# EAGLE design belamini_breakout_v01 (EAGLE 9.3.2)

## Sheet 1 of 5: Headers
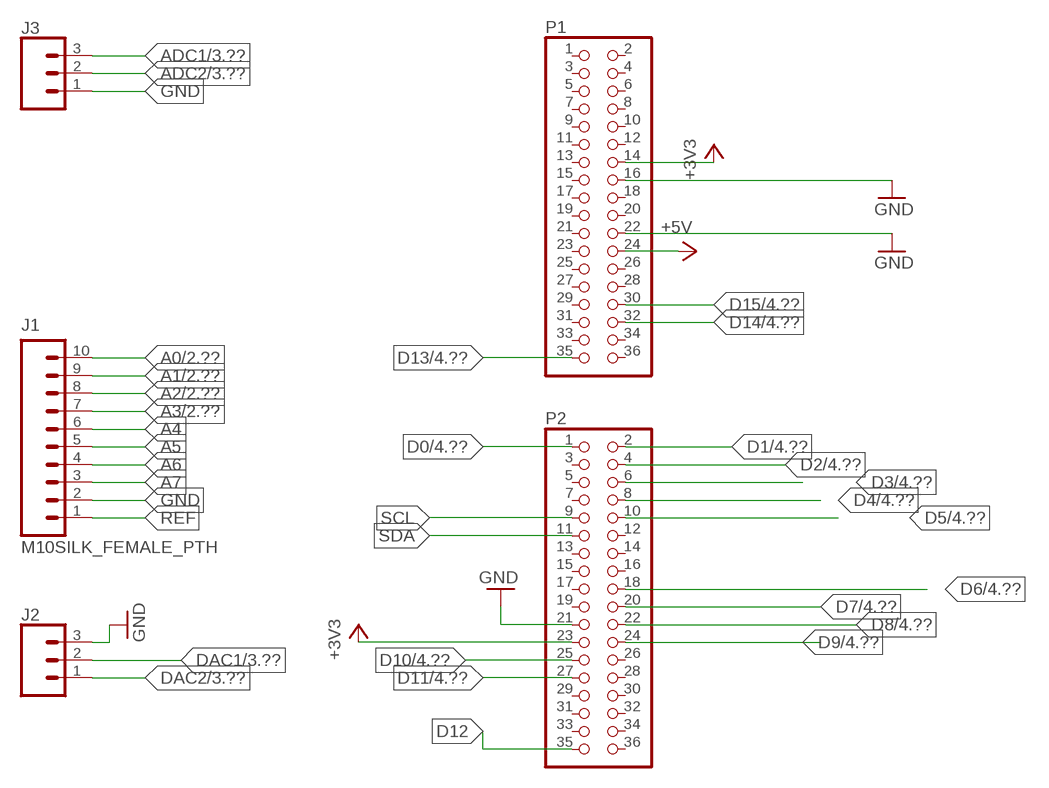
[diagram p0: schematic, sheet 1]

### Parts
J1  M10SILK_FEMALE_PTH  [1X10]
J2  CONN_03  [1X03]
J3  CONN_03  [1X03]
P1  PINHD-2X18  [2X18]
P2  PINHD-2X18  [2X18]

### Nets
+3V3: P1.14 P2.23 ; also sheet 4,5
+5V: P1.24 ; also sheet 5
A0: J1.10 ; also sheet 2
A1: J1.9 ; also sheet 2
A2: J1.8 ; also sheet 2
A3: J1.7 ; also sheet 2
A4: J1.6
A5: J1.5
A6: J1.4
A7: J1.3
ADC1: J3.3 ; also sheet 3
ADC2: J3.2 ; also sheet 3
D0: P2.1 ; also sheet 4
D1: P2.2 ; also sheet 4
D2: P2.4 ; also sheet 4
D3: P2.6 ; also sheet 4
D4: P2.8 ; also sheet 4
D5: P2.10 ; also sheet 4
D6: P2.18 ; also sheet 4
D7: P2.20 ; also sheet 4
D8: P2.22 ; also sheet 4
D9: P2.24 ; also sheet 4
D10: P2.25 ; also sheet 4
D11: P2.27 ; also sheet 4
D12: P2.35
D13: P1.35 ; also sheet 4
D14: P1.32 ; also sheet 4
D15: P1.30 ; also sheet 4
DAC1: J2.2 ; also sheet 3
DAC2: J2.1 ; also sheet 3
GND: J1.2 J2.3 J3.1 P1.16 P1.22 P2.21 ; also sheet 2,3,4,5
REF: J1.1
SCL: P2.9
SDA: P2.11
Unconnected: P1.1 P1.2 P1.3 P1.4 P1.5 P1.6 P1.7 P1.8 P1.9 P1.10 P1.11 P1.12 P1.13 P1.15 P1.17 P1.18 P1.19 P1.20 P1.21 P1.23 P1.25 P1.26 P1.27 P1.28 P1.29 P1.31 P1.33 P1.34 P1.36 P2.3 P2.5 P2.7 P2.12 P2.13 P2.14 P2.15 P2.16 P2.17 P2.19 P2.26 P2.28 P2.29 P2.30 P2.31 P2.32 P2.33 P2.34 P2.36

## Sheet 2 of 5: Analog Inputs
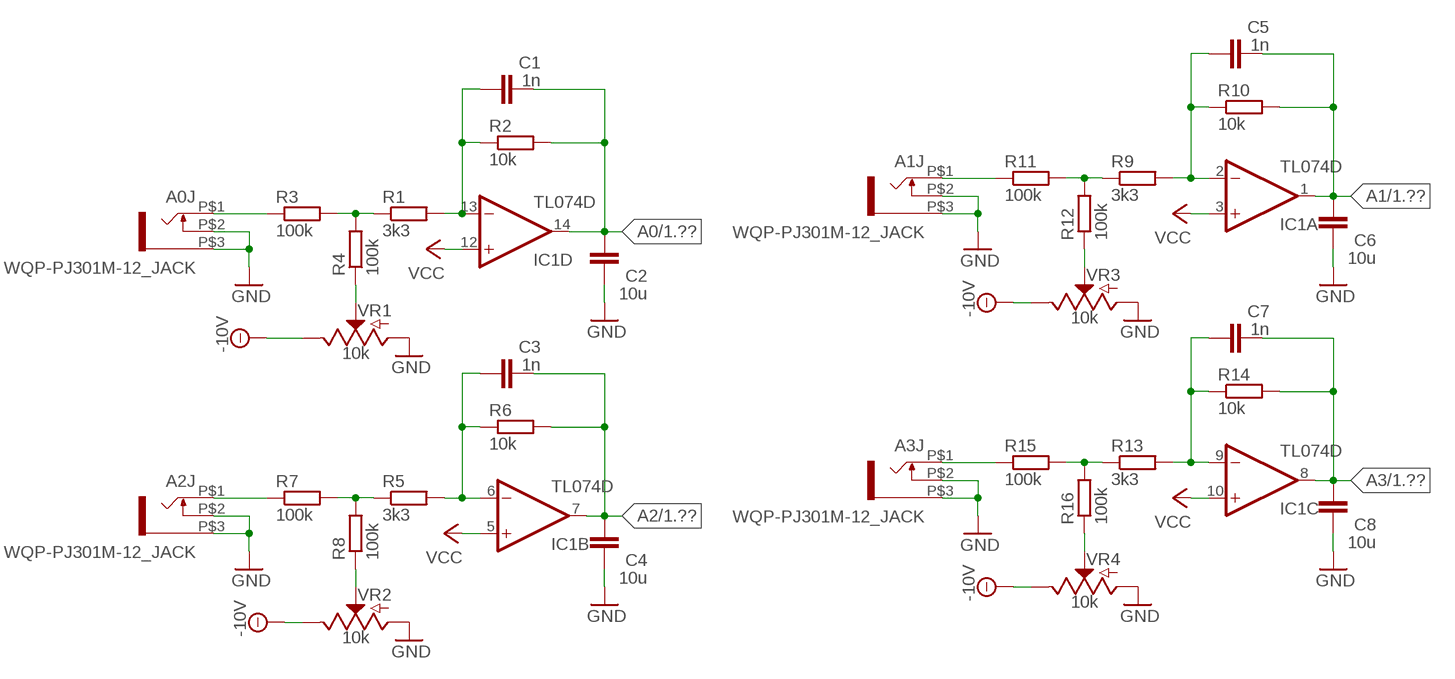
[diagram p1: schematic, sheet 2]

### Parts
A0J  WQP-PJ301M-12_JACK  [WQP-PJ301M-12_JACK]
A1J  WQP-PJ301M-12_JACK  [WQP-PJ301M-12_JACK]
A2J  WQP-PJ301M-12_JACK  [WQP-PJ301M-12_JACK]
A3J  WQP-PJ301M-12_JACK  [WQP-PJ301M-12_JACK]
C1  1n  C-EUC0603  [C0603]
C2  10u  C-EUC0603  [C0603]
C3  1n  C-EUC0603  [C0603]
C4  10u  C-EUC0603  [C0603]
C5  1n  C-EUC0603  [C0603]
C6  10u  C-EUC0603  [C0603]
C7  1n  C-EUC0603  [C0603]
C8  10u  C-EUC0603  [C0603]
IC1  TL074D  [SO14]
R1  3k3  R-EU_R0603  [R0603]
R2  10k  R-EU_R0603  [R0603]
R3  100k  R-EU_R0603  [R0603]
R4  100k  R-EU_R0603  [R0603]
R5  3k3  R-EU_R0603  [R0603]
R6  10k  R-EU_R0603  [R0603]
R7  100k  R-EU_R0603  [R0603]
R8  100k  R-EU_R0603  [R0603]
R9  3k3  R-EU_R0603  [R0603]
R10  10k  R-EU_R0603  [R0603]
R11  100k  R-EU_R0603  [R0603]
R12  100k  R-EU_R0603  [R0603]
R13  3k3  R-EU_R0603  [R0603]
R14  10k  R-EU_R0603  [R0603]
R15  100k  R-EU_R0603  [R0603]
R16  100k  R-EU_R0603  [R0603]
VR1  10k  POTENTIOMETER-PTH-9MM-1/20W-20%-KIT  [POT-PTH-ALPS-KIT]
VR2  10k  POTENTIOMETER-PTH-9MM-1/20W-20%-KIT  [POT-PTH-ALPS-KIT]
VR3  10k  POTENTIOMETER-PTH-9MM-1/20W-20%-KIT  [POT-PTH-ALPS-KIT]
VR4  10k  POTENTIOMETER-PTH-9MM-1/20W-20%-KIT  [POT-PTH-ALPS-KIT]

### Nets
-10V: VR1.P$1(E) VR2.P$1(E) VR3.P$1(E) VR4.P$1(E) ; also sheet 5
A0: C1.2 C2.2 IC1.14(D:OUT) R2.2 ; also sheet 1
A1: C5.2 C6.2 IC1.1(A:OUT) R10.2 ; also sheet 1
A2: C3.2 C4.2 IC1.7(B:OUT) R6.2 ; also sheet 1
A3: C7.2 C8.2 IC1.8(C:OUT) R14.2 ; also sheet 1
GND: A0J.P$2 A0J.P$3 A1J.P$2 A1J.P$3 A2J.P$2 A2J.P$3 A3J.P$2 A3J.P$3 C2.1 C4.1 C6.1 C8.1 VR1.P$3(A) VR2.P$3(A) VR3.P$3(A) VR4.P$3(A) ; also sheet 1,3,4,5
N$1: A0J.P$1 R3.1
N$2: C1.1 IC1.13(D:-IN) R1.2 R2.1
N$3: R1.1 R3.2 R4.2
N$4: R4.1 VR1.P$2(S)
N$5: C3.1 IC1.6(B:-IN) R5.2 R6.1
N$6: R5.1 R7.2 R8.2
N$7: A2J.P$1 R7.1
N$8: R8.1 VR2.P$2(S)
N$9: C5.1 IC1.2(A:-IN) R9.2 R10.1
N$10: R9.1 R11.2 R12.2
N$11: A1J.P$1 R11.1
N$12: R12.1 VR3.P$2(S)
N$13: C7.1 IC1.9(C:-IN) R13.2 R14.1
N$14: R13.1 R15.2 R16.2
N$15: A3J.P$1 R15.1
N$16: R16.1 VR4.P$2(S)
VCC: IC1.3(A:+IN) IC1.5(B:+IN) IC1.10(C:+IN) IC1.12(D:+IN) ; also sheet 3,5

## Sheet 3 of 5: Audio IO
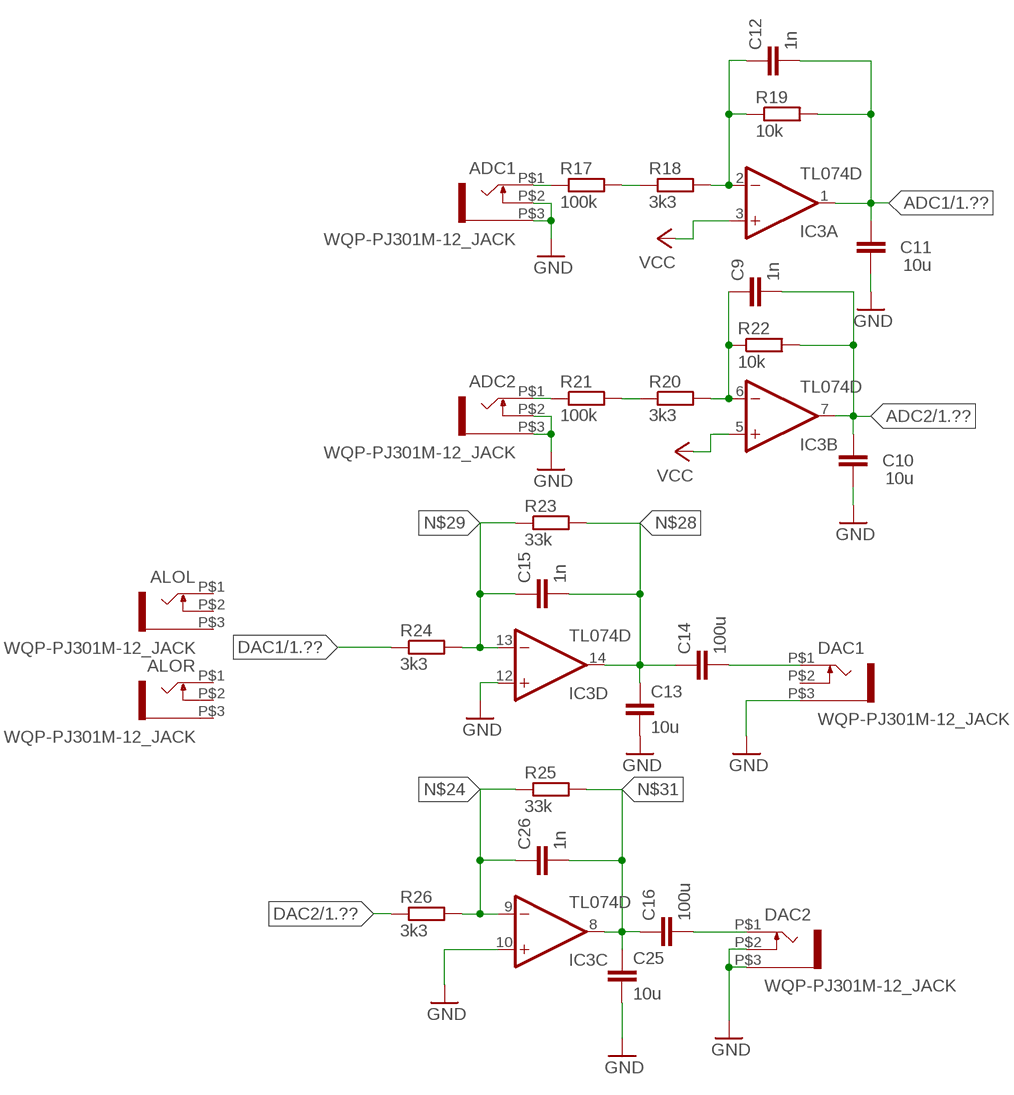
[diagram p2: schematic, sheet 3]

### Parts
ADC1  WQP-PJ301M-12_JACK  [WQP-PJ301M-12_JACK]
ADC2  WQP-PJ301M-12_JACK  [WQP-PJ301M-12_JACK]
ALOL  WQP-PJ301M-12_JACK  [WQP-PJ301M-12_JACK]
ALOR  WQP-PJ301M-12_JACK  [WQP-PJ301M-12_JACK]
C9  1n  C-EUC0603  [C0603]
C10  10u  C-EUC0603  [C0603]
C11  10u  C-EUC0603  [C0603]
C12  1n  C-EUC0603  [C0603]
C13  10u  C-EUC0603  [C0603]
C14  100u  C-EUC0603  [C0603]
C15  1n  C-EUC0603  [C0603]
C16  100u  C-EUC0603  [C0603]
C25  10u  C-EUC0603  [C0603]
C26  1n  C-EUC0603  [C0603]
DAC1  WQP-PJ301M-12_JACK  [WQP-PJ301M-12_JACK]
DAC2  WQP-PJ301M-12_JACK  [WQP-PJ301M-12_JACK]
IC3  TL074D  [SO14]
R17  100k  R-EU_R0603  [R0603]
R18  3k3  R-EU_R0603  [R0603]
R19  10k  R-EU_R0603  [R0603]
R20  3k3  R-EU_R0603  [R0603]
R21  100k  R-EU_R0603  [R0603]
R22  10k  R-EU_R0603  [R0603]
R23  33k  R-EU_R0603  [R0603]
R24  3k3  R-EU_R0603  [R0603]
R25  33k  R-EU_R0603  [R0603]
R26  3k3  R-EU_R0603  [R0603]

### Nets
ADC1: C11.2 C12.2 IC3.1(A:OUT) R19.2 ; also sheet 1
ADC2: C9.2 C10.2 IC3.7(B:OUT) R22.2 ; also sheet 1
DAC1: R24.1 ; also sheet 1
DAC2: R26.1 ; also sheet 1
GND: ADC1.P$2 ADC1.P$3 ADC2.P$2 ADC2.P$3 C10.1 C11.1 C13.2 C25.2 DAC1.P$3 DAC2.P$2 DAC2.P$3 IC3.10(C:+IN) IC3.12(D:+IN) ; also sheet 1,2,4,5
N$20: ADC1.P$1 R17.1
N$21: R17.2 R18.1
N$22: C12.1 IC3.2(A:-IN) R18.2 R19.1
N$23: C9.1 IC3.6(B:-IN) R20.2 R22.1
N$24: C26.1 IC3.9(C:-IN) R25.1 R26.2
N$25: R20.1 R21.2
N$26: ADC2.P$1 R21.1
N$27: C14.2 DAC1.P$1
N$28: C13.1 C14.1 C15.2 IC3.14(D:OUT) R23.2
N$29: C15.1 IC3.13(D:-IN) R23.1 R24.2
N$31: C16.1 C25.1 C26.2 IC3.8(C:OUT) R25.2
N$32: C16.2 DAC2.P$1
VCC: IC3.3(A:+IN) IC3.5(B:+IN) ; also sheet 2,5
Unconnected: ALOL.P$1 ALOL.P$2 ALOL.P$3 ALOR.P$1 ALOR.P$2 ALOR.P$3 DAC1.P$2

## Sheet 4 of 5: Buttons and Encoder
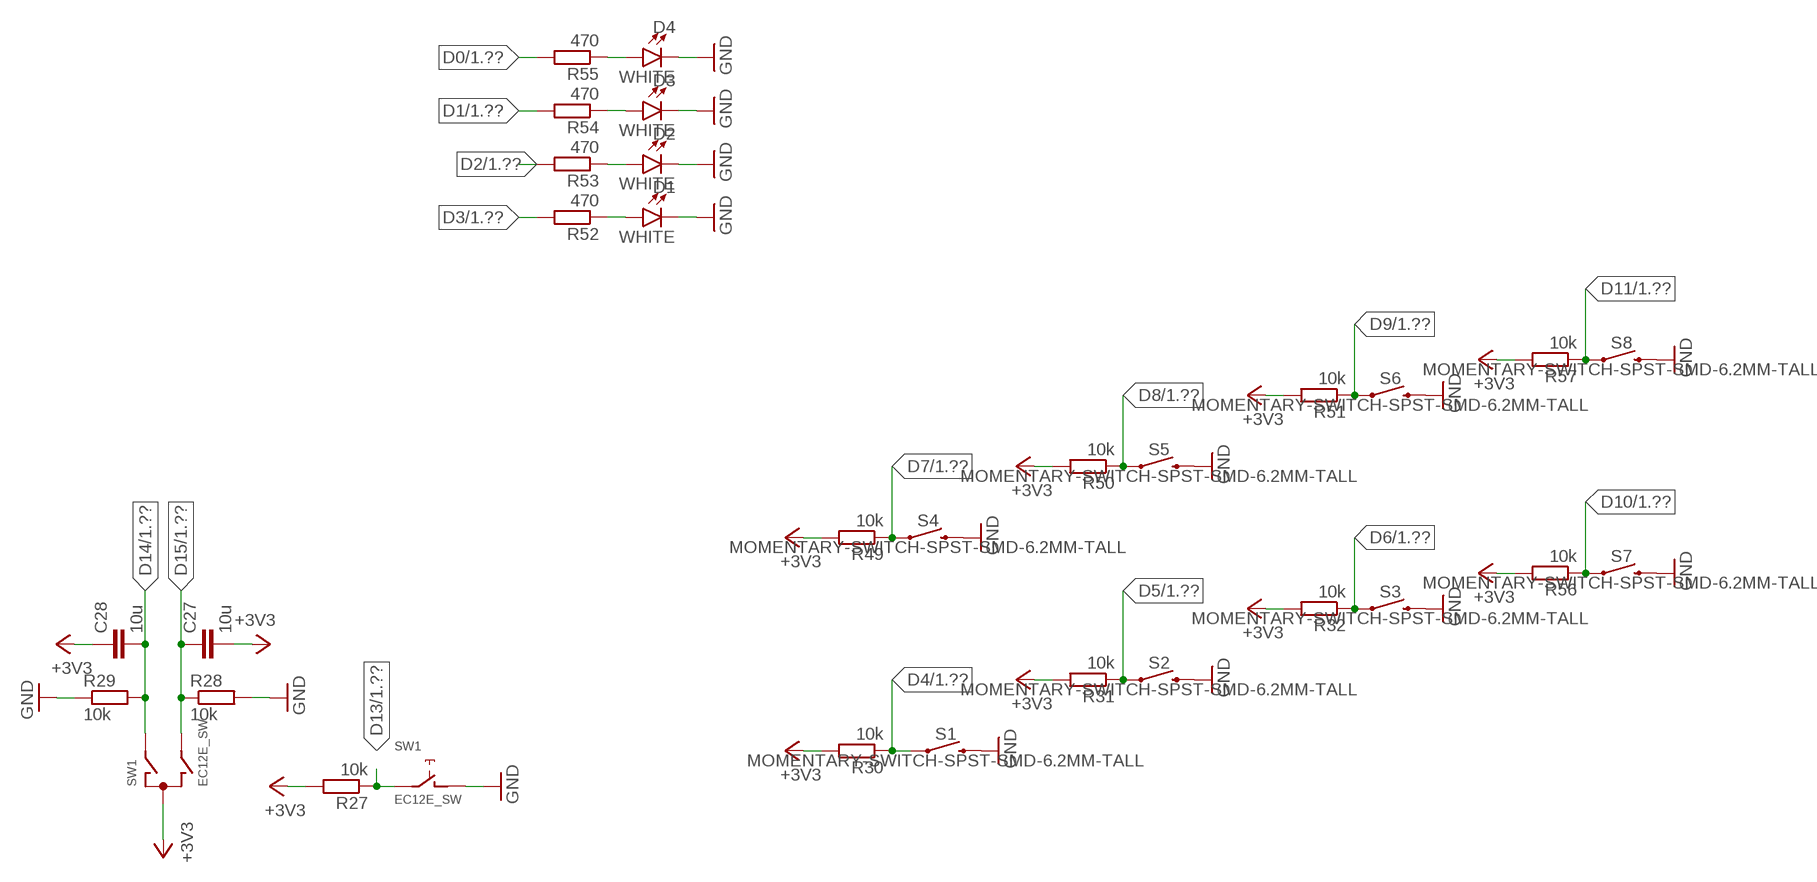
[diagram p3: schematic, sheet 4]

### Parts
C27  10u  C-EUC0603  [C0603]
C28  10u  C-EUC0603  [C0603]
D1  WHITE  LED-WHITE1206  [LED-1206]
D2  WHITE  LED-WHITE1206  [LED-1206]
D3  WHITE  LED-WHITE1206  [LED-1206]
D4  WHITE  LED-WHITE1206  [LED-1206]
R27  10k  R-EU_R0603  [R0603]
R28  10k  R-EU_R0603  [R0603]
R29  10k  R-EU_R0603  [R0603]
R30  10k  R-EU_R0603  [R0603]
R31  10k  R-EU_R0603  [R0603]
R32  10k  R-EU_R0603  [R0603]
R49  10k  R-EU_R0603  [R0603]
R50  10k  R-EU_R0603  [R0603]
R51  10k  R-EU_R0603  [R0603]
R52  470  R-EU_R0603  [R0603]
R53  470  R-EU_R0603  [R0603]
R54  470  R-EU_R0603  [R0603]
R55  470  R-EU_R0603  [R0603]
R56  10k  R-EU_R0603  [R0603]
R57  10k  R-EU_R0603  [R0603]
S1  MOMENTARY-SWITCH-SPST-SMD-6.2MM-TALL  [TACTILE_SWITCH_SMD_6.2MM_TALL]
S2  MOMENTARY-SWITCH-SPST-SMD-6.2MM-TALL  [TACTILE_SWITCH_SMD_6.2MM_TALL]
S3  MOMENTARY-SWITCH-SPST-SMD-6.2MM-TALL  [TACTILE_SWITCH_SMD_6.2MM_TALL]
S4  MOMENTARY-SWITCH-SPST-SMD-6.2MM-TALL  [TACTILE_SWITCH_SMD_6.2MM_TALL]
S5  MOMENTARY-SWITCH-SPST-SMD-6.2MM-TALL  [TACTILE_SWITCH_SMD_6.2MM_TALL]
S6  MOMENTARY-SWITCH-SPST-SMD-6.2MM-TALL  [TACTILE_SWITCH_SMD_6.2MM_TALL]
S7  MOMENTARY-SWITCH-SPST-SMD-6.2MM-TALL  [TACTILE_SWITCH_SMD_6.2MM_TALL]
S8  MOMENTARY-SWITCH-SPST-SMD-6.2MM-TALL  [TACTILE_SWITCH_SMD_6.2MM_TALL]
SW1  EC12E_SW  [ALPS_EC12E_SW]

### Nets
+3V3: C27.2 C28.1 R27.2 R30.2 R31.2 R32.2 R49.2 R50.2 R51.2 R56.2 R57.2 SW1.C ; also sheet 1,5
D0: R55.2 ; also sheet 1
D1: R54.2 ; also sheet 1
D2: R53.2 ; also sheet 1
D3: R52.2 ; also sheet 1
D4: R30.1 S1.A2 ; also sheet 1
D5: R31.1 S2.A2 ; also sheet 1
D6: R32.1 S3.A2 ; also sheet 1
D7: R49.1 S4.A2 ; also sheet 1
D8: R50.1 S5.A2 ; also sheet 1
D9: R51.1 S6.A2 ; also sheet 1
D10: R56.1 S7.A2 ; also sheet 1
D11: R57.1 S8.A2 ; also sheet 1
D13: R27.1 SW1.E ; also sheet 1
D14: C28.2 R29.2 SW1.A ; also sheet 1
D15: C27.1 R28.1 SW1.B ; also sheet 1
GND: D1.C D2.C D3.C D4.C R28.2 R29.1 S1.B2 S2.B2 S3.B2 S4.B2 S5.B2 S6.B2 S7.B2 S8.B2 SW1.D ; also sheet 1,2,3,5
N$30: D4.A R55.1
N$37: D3.A R54.1
N$41: D2.A R53.1
N$45: D1.A R52.1
Unconnected: SW1.GND1(G) SW1.GND2(G)

## Sheet 5 of 5: PSU
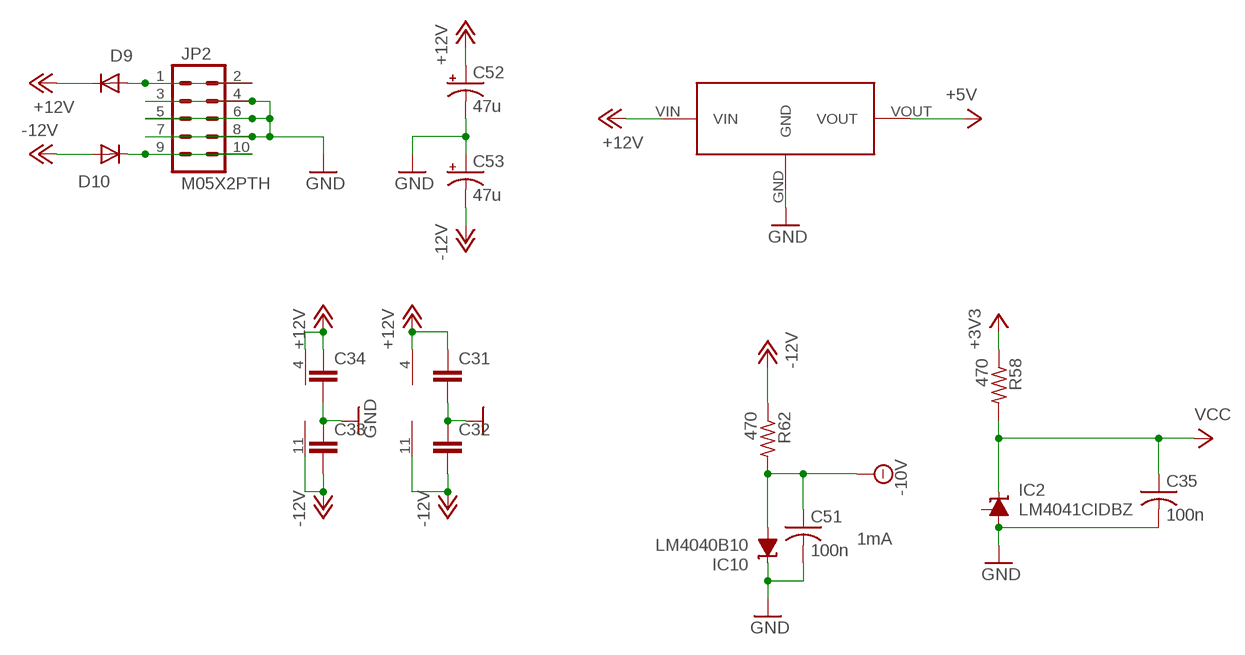
[diagram p4: schematic, sheet 5]

### Parts
C31  C-EUC0603  [C0603]
C32  C-EUC0603  [C0603]
C33  C-EUC0603  [C0603]
C34  C-EUC0603  [C0603]
C35  100n  C-USC0603  [C0603]
C51  100n  C-USC0603  [C0603]
C52  47u  CPOL-USD  [PANASONIC_D]
C53  47u  CPOL-USD  [PANASONIC_D]
D9  1N5819HW  DIODE-SOD123  [SOD123]
D10  1N5819HW  DIODE-SOD123  [SOD123]
IC2  LM4041CIDBZ  [DBZ_R-PDSO-G3]
IC10  LM4040B10  LM4041B12DBZ  [DBZ_R-PDSO-G3]
JP2  M05X2PTH  [AVR_ICSP]
R58  470  R-US_R0603  [R0603]
R62  470  R-US_R0603  [R0603]
U$1  RECOM785.0  [R-78XX-1.0]

### Nets
+3V3: R58.1 ; also sheet 1,4
+5V: U$1.VOUT ; also sheet 1
+12V: C31.1 C34.1 C52.+ D9.C IC1.4(P:V+) IC3.4(P:V+) U$1.VIN
-10V: C51.1 IC10.2(A) R62.2 ; also sheet 2
-12V: C32.2 C33.2 C53.- D10.A IC1.11(P:V-) IC3.11(P:V-) R62.1
GND: C31.2 C32.1 C33.1 C34.2 C35.2 C51.2 C52.- C53.+ IC2.3(A) IC10.1(C) JP2.3 JP2.4 JP2.5 JP2.6 JP2.7 JP2.8 U$1.GND ; also sheet 1,2,3,4
N$52: D9.A JP2.1 JP2.2
N$53: D10.C JP2.9 JP2.10
VCC: C35.1 IC2.2(C) R58.2 ; also sheet 2,3
Unconnected: IC2.1(FB)

### Notes on the sheet
- 1mA

## Library data of the parts
A0J A1J A2J A3J ADC1 ADC2 ALOL ALOR DAC1 DAC2 = thonkiconn:WQP-PJ301M-12_JACK
C1-C16 C25-C28 C31-C34 = resistor:C-EU: CAPACITOR, European symbol
C35 C51 = rcl:C-US: CAPACITOR, American symbol
C52 C53 = rcl:CPOL-US: POLARIZED CAPACITOR, American symbol
D1-D4 = SparkFun-LED:LED-WHITE: White SMD LED Used in manufacturing several products at SparkFun. Packages: 0603 - Bright White SMD 0603 package[Product Link] <http://www.kingbrightusa.com/product.asp?catalog_name=LED&product_id=APT1608QWF/D> 1206 - Bright White SMD1206 package [Product Link] <http://www.kingbrightusa.com/product.asp?catalog_name=LED&product_id=APT3216QWF/D> 3014 - Super Bright SMD 3014 package [Datasheet] <http://www.lumileds.com/uploads/459/DS208-pdf> SparkFun Products: Blackberry Trackballer Breakout <https://www.sparkfun.com/products/13169> Digital SandBox <https://www.sparkfun.com/products/12651>; PROD_ID: DIO-09955
D9 D10 = diode:DIODE-: DIODE
IC1 IC3 = linear:TL074: OP AMP
IC2 = texas:LM4041*I: PRECISION MICROPOWER SHUNT VOLTAGE REFERENCE Adjustable Output Source: http://focus.ti.com/lit/ds/slcs146e/slcs146e.pdf; MF: TEXAS INSTRUMENT CONNECTORS; MPN: LM4041CIDBZR; OC_FARNELL: unknown; OC_NEWARK: 31K7136
IC10 = texas:LM4041: PRECISION MICROPOWER SHUNT VOLTAGE REFERENCE Source: http://focus.ti.com/lit/ds/slcs146e/slcs146e.pdf
J1 = SparkFun-Connectors:M10: Header 10 Standard 10-pin 0.1" header. Use with straight break away headers (SKU : PRT-00116), right angle break away headers (PRT-00553), swiss pins (PRT-00743), machine pins (PRT-00117), and female headers (PRT-00115).; PROD_ID: CONN-11563
J2 J3 = SparkFun-Connectors:CONN_03: Multi connection point. Often used as Generic Header-pin footprint for 0.1 inch spaced/style header connections On any of the 0.1 inch spaced packages, you can populate with these: Break Away Headers - Straight (PRT-00116) Break Away Male Headers - Right Angle (PRT-00553) Female Headers (PRT-00115) Break Away Headers - Machine Pin (PRT-00117) Break Away Female Headers - Swiss Machine Pin (PRT-00743) Stackable Header - 3 Pin (Female, 0.1") (PRT-13875) For SCREWTERMINALS and SPRING TERMINALS visit here: Screw Terimnals on SparkFun.com (5mm/3.5mm/2.54mm spacing) This device is also useful as a general connection point to wire up your design to another part of your project. Our various solder wires solder well into these plated through hole pads. Hook-Up Wire - Assortment (Stranded, 22 AWG) (PRT-11375) Hook-Up Wire - Assortment (Solid Core, 22 AWG) (PRT-11367) View the entire wire category on our website here Special notes: Molex polarized connector foot print use with SKU : PRT-08232 with associated crimp pins and housings.
JP2 = og-header:M05X2: Header 5x2 Standard 10-pin dual row 0.1" header. Commonly used with AVR-ISP. Use with Spark Fun Electronics SKU: PRT-00778
P1 P2 = pinhead:PINHD-2X18: PIN HEADER
R1-R32 R49-R57 = resistor:R-EU_: RESISTOR, European symbol
R58 R62 = rcl:R-US_: RESISTOR, American symbol
S1-S8 = SparkFun-Switches:MOMENTARY-SWITCH-SPST: Momentary Switch (Pushbutton) - SPST Normally-open (NO) SPST momentary switches (buttons, pushbuttons). Variants PTH-12MM - 12mm square, through-hole Momentary Pushbutton Switch - 12mm Square (COM-09190) PTH-6.0MM, PTH-6.0MM-KIT - 6.0mm square, through-hole Mini Pushbutton Switch (COM-00097) KIT package intended for soldering kit's - only one side of pads' copper is exposed. PTH-RIGHT-ANGLE-KIT - Right-angle, through-hole Right Angle Tactile Button - Used on SparkFun BigTime Watch Kit SMD-12MM - 12mm square, surface-mount Tactile Button - SMD (12mm) (COM-12993) Used on SparkFun PicoBoard SMD-4.5MM - 4.5mm Square Trackball Switch Used on SparkFun Blackberry Trackballer Breakout SMD-4.6MMX2.8MM - 4.60mm x 2.80mm, surface mount Used on SparkFun SAMD21 Mini Breakout SMD-5.2MM, SMD-5.2-REDUNDANT - 5.2mm square, surface-mount Mini Pushbutton Switch - SMD (COM-08720) Used on Arduino Pro Mini REDUNDANT package connects both switch circuits together SMD-6.0X3.5MM - 6.0 x 3.5mm, surface mount Momentary Reset Switch SMD (COM-08229) SMD-6.2MM-TALL - 6.2mm square, surface mount Tactile Button - SMD (6mm) Used on SparkFun Digital Sandbox SMD-RIGHT-ANGLE - Right-angle, surface mount Used on SparkFun Block for Intel® Edison - Arduino; PROD_ID: SWCH-11966; SF_SKU: COM-12992
SW1 = switch-alps:EC12E_SW: ALPS rotary Encoder EC12E series with switch; MPN: EC12E2424407; OC_FARNELL: 1520813; OC_NEWARK: 74M1068
U$1 = audioic:RECOM785.0
VR1-VR4 = SparkFun-Resistors:POTENTIOMETER: Potentiometer (Pot) Three-terminal potentiometers, with an adjustable wiper and two adjustable resistors. A pot can be used to create a configurable voltage divider, or as a variable resistor. Variants ALPS_POT and ALPS_POT_KIT - PTH, breadboard compatible, 9mm square pots Rotary Potentiometer - Linear (10k ohm) (COM-09288) The KIT variant exposes copper on only one side of the PTH pad, so the part can only be assembled on one side of the PCB. Useful for beginner soldering kits.; PROD_ID: RES-09177; SF_SKU: COM-09288

## Board
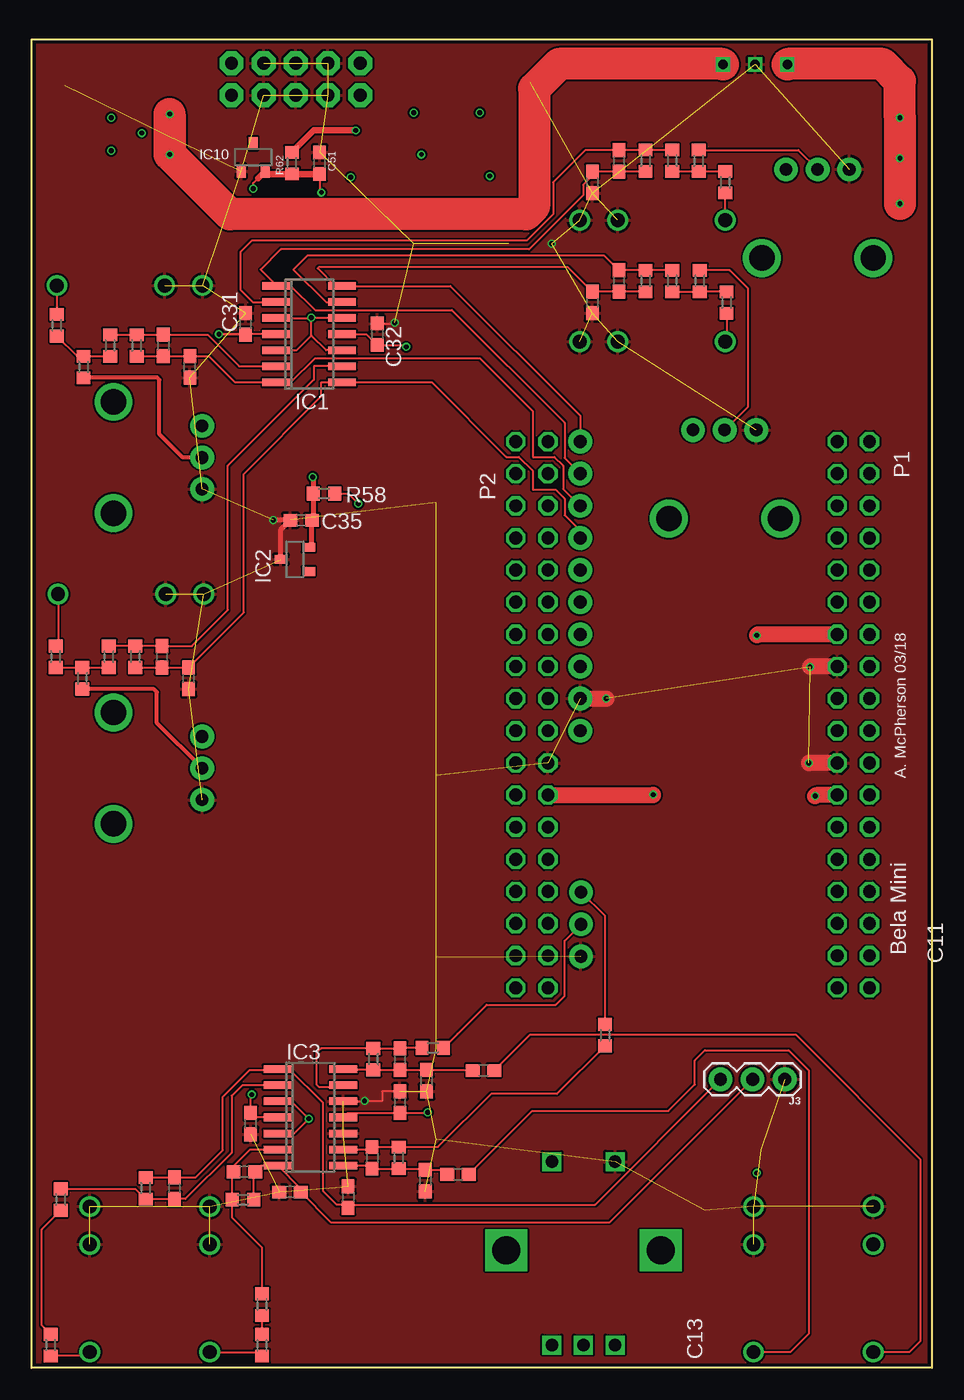
[diagram p5: board, top side]
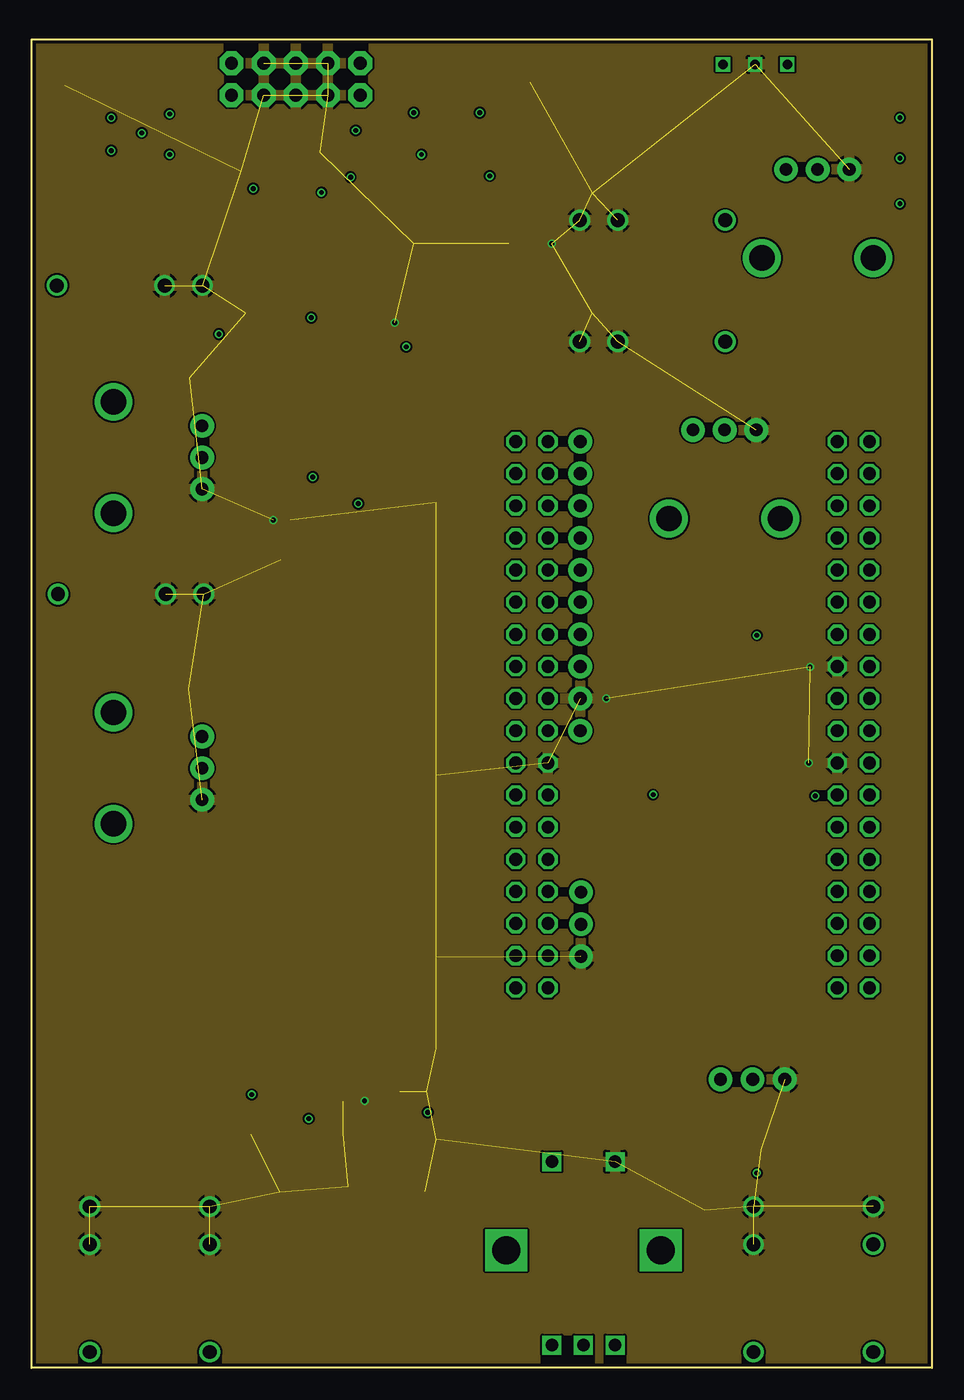
[diagram p6: board, inner layer Route2]
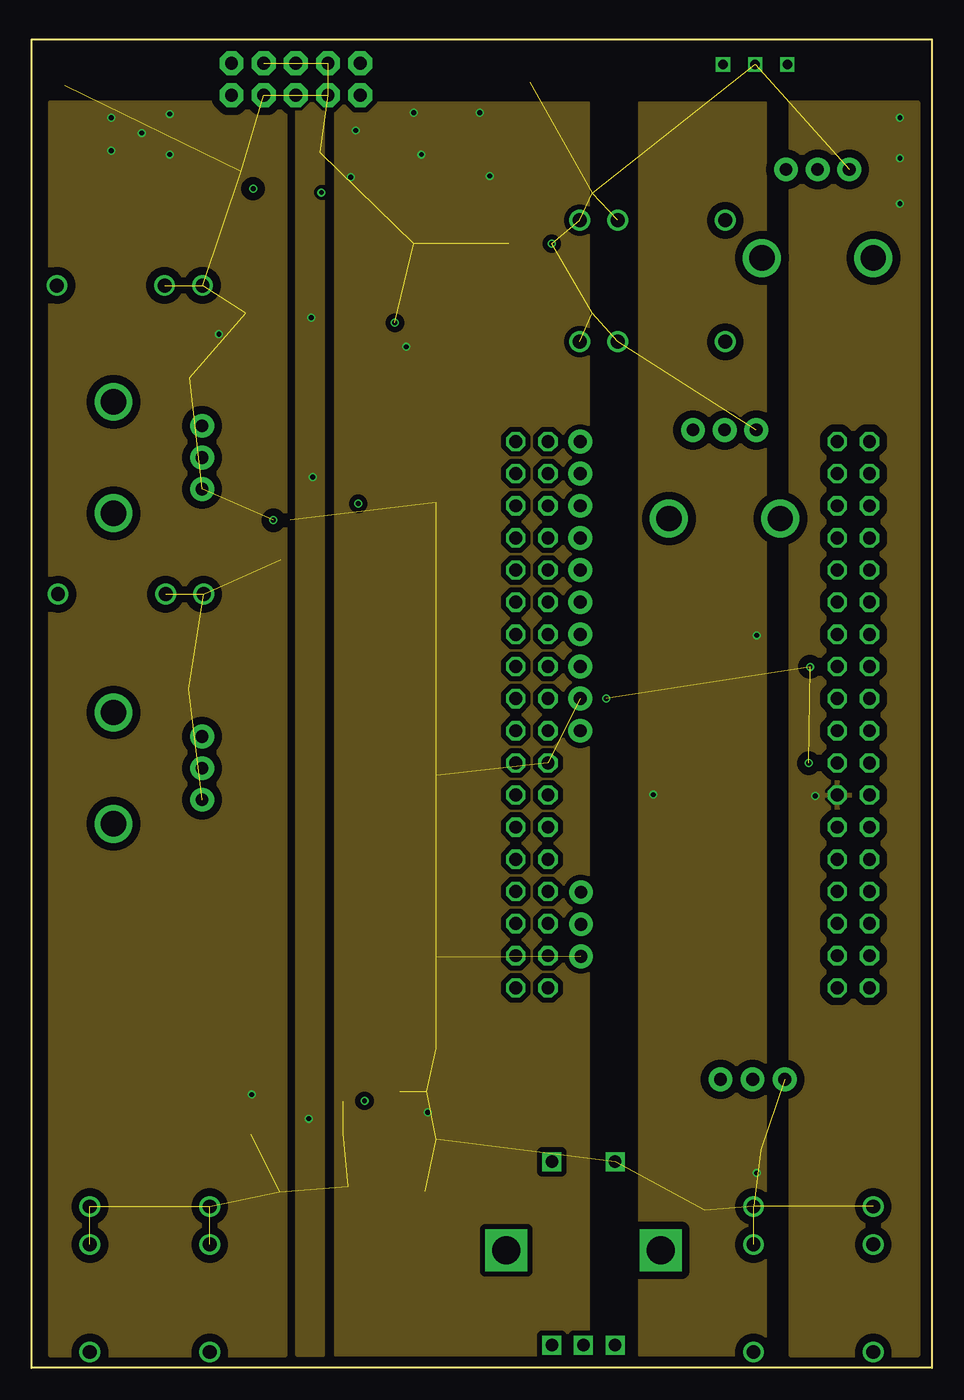
[diagram p7: board, inner layer Route3]
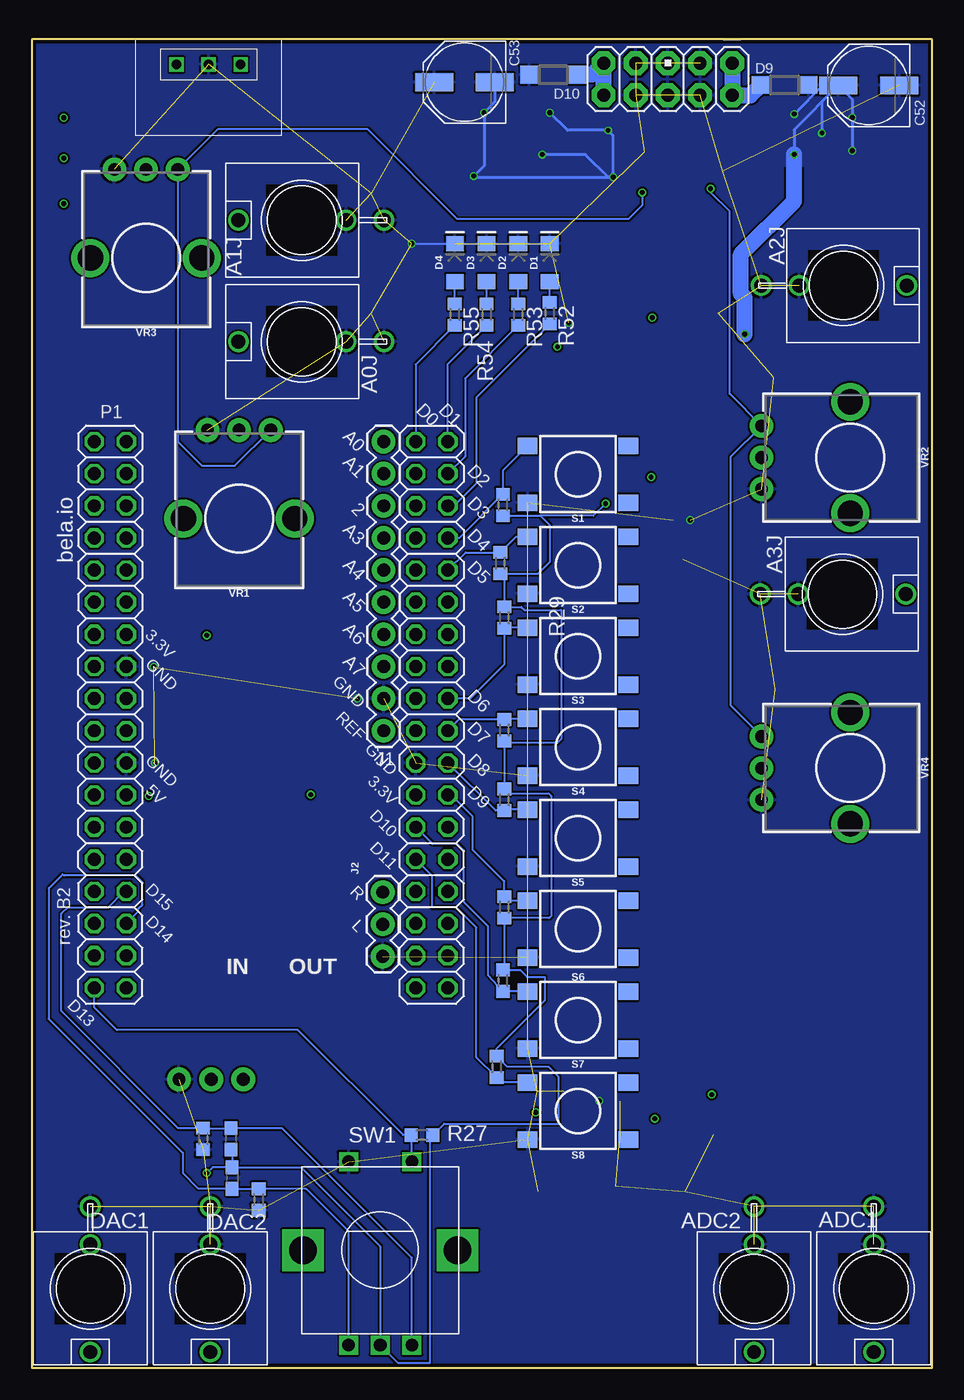
[diagram p8: board, bottom side, seen from below]

Size 71.12 x 105 mm. Coordinates in mm from the lower left corner, seen from the top.
Outline: 0,0 0,105 71.12,105 71.12,0 0,0
Copper layers (1+2*3+16): Top 0.018mm / dielectric 0.36mm / Route2 0.035mm / dielectric 0.71mm / Route3 0.035mm / dielectric 0.36mm / Bottom 0.018mm
Design rules "eC_4Layer_PClass6_BaseCopperO18-I35_eCDefault": minimum track width 0.15mm, minimum drill 0.35mm, track to track 0.15mm, track to pad 0.15mm, pad to pad 0.15mm, via to via 0.15mm, smd to smd 0mil, copper to edge 0.25mm, drill to drill 0.35mm, minimum pad ring 0.175mm, minimum via ring 0.125mm, stop-mask expansion 0mil, vias tented up to drill 0.45mm, thermal gap 0.2mm

### Footprints (pad centres in the part's own frame; a part is rotated, then mirrored left to right if it is on the bottom)
WQP-PJ301M-12_JACK = drill 1.1: P$1 0,5; P$2 0,-3.5; P$3 0,-6.5
C0603 = smd 1.1 x 1: 1 -0.85,0; 2 0.85,0
PANASONIC_D = smd 3 x 1.4: + 2.4,0; - -2.4,0
LED-1206 = smd 1.2 x 1.4: A -1.5,0; C 1.5,0
SOD123 = smd 1.4 x 1.4: A 1.9,0; C -1.9,0
SO14 = smd 0.6 x 2.2: 1 -3.81,-2.6; 2 -2.54,-2.6; 3 -1.27,-2.6; 4 0,-2.6; 5 1.27,-2.6; 6 2.54,-2.6; 7 3.81,-2.6; 8 3.81,2.6; 9 2.54,2.6; 10 1.27,2.6; 11 0,2.6; 12 -1.27,2.6; 13 -2.54,2.6; 14 -3.81,2.6
DBZ_R-PDSO-G3 = smd 0.7 x 1: 1 -0.95,-1.1; 2 0.95,-1.1; 3 0,1.1
1X10 = drill 1.016 pad 1.88: 1 0,0; 2 2.54,0; 3 5.08,0; 4 7.62,0; 5 10.16,0; 6 12.7,0; 7 15.24,0; 8 17.78,0; 9 20.32,0; 10 22.86,0
1X03 = drill 1.016 pad 1.88: 1 0,0; 2 2.54,0; 3 5.08,0
AVR_ICSP = drill 1.016 pad 1.88 octagon: 1 -1.27,5.08; 2 1.27,5.08; 3 -1.27,2.54; 4 1.27,2.54; 5 -1.27,0; 6 1.27,0; 7 -1.27,-2.54; 8 1.27,-2.54; 9 -1.27,-5.08; 10 1.27,-5.08
2X18 = drill 1.016 octagon: 1 -21.59,-1.27; 2 -21.59,1.27; 3 -19.05,-1.27; 4 -19.05,1.27; 5 -16.51,-1.27; 6 -16.51,1.27; 7 -13.97,-1.27; 8 -13.97,1.27; 9 -11.43,-1.27; 10 -11.43,1.27; 11 -8.89,-1.27; 12 -8.89,1.27; 13 -6.35,-1.27; 14 -6.35,1.27; 15 -3.81,-1.27; 16 -3.81,1.27; 17 -1.27,-1.27; 18 -1.27,1.27; 19 1.27,-1.27; 20 1.27,1.27; 21 3.81,-1.27; 22 3.81,1.27; 23 6.35,-1.27; 24 6.35,1.27; 25 8.89,-1.27; 26 8.89,1.27; 27 11.43,-1.27; 28 11.43,1.27; 29 13.97,-1.27; 30 13.97,1.27; 31 16.51,-1.27; 32 16.51,1.27; 33 19.05,-1.27; 34 19.05,1.27; 35 21.59,-1.27; 36 21.59,1.27
R0603 = smd 1 x 1.1: 1 -0.85,0; 2 0.85,0
TACTILE_SWITCH_SMD_6.2MM_TALL = smd 1.55 x 1.3: A1 -3.975,-2.25; A2 3.975,-2.25; B1 -3.975,2.25; B2 3.975,2.25
ALPS_EC12E_SW = drill 1 square: A -2.5,-7.5; B 2.5,-7.5; C 0,-7.5; D -2.5,7; E 2.5,7 | drill 2.2 square: GND1 -6.1,0; GND2 6.1,0
R-78XX-1.0 = drill 0.75 square: GND 5.76,1.98; VIN 3.22,1.98; VOUT 8.3,1.98
POT-PTH-ALPS-KIT = drill 1 pad 1.88: P$1 7,-2.5; P$2 7,0; P$3 7,2.5 | drill 2: P$4 0,-4.4; P$5 0,4.4

### Placement (x,y rotation side)
A0J  49.8,81.1 90 bottom
A1J  49.8,90.7 90 bottom
A2J  7,85.55 270 bottom
A3J  7.08,61.15 270 bottom
ADC1  4.6,6.25 180 bottom
ADC2  14.07,6.25 180 bottom
ALOL  -137.8,7.4 0 top  (outside the outline)
ALOR  -149,7.4 0 top  (outside the outline)
C1  46.4,85.9 270 top
C2  44.3,84.2 90 top
C3  10.4,80.8 270 top
C4  12.5,79.1 90 top
C5  46.4,95.4 270 top
C6  44.3,93.7 90 top
C7  10.3,56.2 270 top
C8  12.4,54.5 90 top
C9  16.8,15.5 0 top
C10  20.4,13.9 0 top
C11  25,13.5 270 top
C12  11.3,14.2 90 top
C13  31.2,22.7 270 top
C14  35.7,23.5 0 top
C15  29.1,24.4 270 top
C16  33.7,15.3 0 top
C25  31.1,14.8 270 top
C26  26.9,16.6 270 top
C27  55.4,18.1 270 bottom
C28  55.3,15 270 bottom
C31  16.9,82.5 90 top
C32  27.3,81.7 270 top
C33  29.1,21 270 top
C34  17.3,19.3 270 top
C35  21.3,67 180 top
C51  22.75,95.21 90 top
C52  5,101.36 180 bottom
C53  36.95,101.61 180 bottom
D1  30.2,87.35 90 bottom
D2  32.7,87.35 90 bottom
D3  35.2,87.35 90 bottom
D4  37.7,87.35 90 bottom
D9  11.65,101.39 180 bottom
D10  29.94,102.2 180 bottom
DAC1  66.5,6.25 180 bottom
DAC2  57.03,6.25 180 bottom
IC1  21.93,81.7 270 top
IC2  20.8,63.9 90 top
IC3  22.02,19.8 270 top
IC10  17.5,95.68 0 top
J1  43.34,50.35 90 bottom
J2  43.4,37.6 270 bottom
J3  59.5,22.8 180 top
JP2  20.87,101.85 270 bottom
P1  64.92,51.62 270 bottom
P2  39.52,51.62 270 bottom
R1  50.6,85.9 90 top
R2  48.5,85.9 270 top
R3  54.9,84.2 90 top
R4  52.8,85.9 270 top
R5  6.2,80.8 90 top
R6  8.3,80.8 270 top
R7  2,82.4 270 top
R8  4.1,79.1 90 top
R9  50.6,95.4 90 top
R10  48.5,95.4 270 top
R11  54.8,93.7 90 top
R12  52.7,95.4 270 top
R13  6.1,56.2 90 top
R14  8.2,56.2 270 top
R15  1.9,56.2 270 top
R16  4,54.5 90 top
R17  1.5,1.8 90 top
R18  2.3,13.3 90 top
R19  9,14.2 90 top
R20  18.2,5 90 top
R21  18.2,1.8 90 top
R22  16.7,13.3 0 top
R23  27,24.4 270 top
R24  31.7,25.3 180 top
R25  29,16.6 270 top
R26  45.3,26.3 270 top
R27  40.3,18.4 0 bottom
R28  57.6,18.1 270 bottom
R29  53.2,13.3 90 bottom
R30  33.9,68.2 270 bottom
R31  34.1,63.6 270 bottom
R32  33.8,59.3 90 bottom
R49  33.8,50.4 270 bottom
R50  33.8,44.9 90 bottom
R51  33.8,36.4 270 bottom
R52  30.2,83.35 270 bottom
R53  32.7,83.25 270 bottom
R54  35.2,83.25 270 bottom
R55  37.7,83.25 270 bottom
R56  33.9,30.6 90 bottom
R57  34.4,23.8 90 bottom
R58  23.1,69.1 180 top
R62  20.57,95.21 270 top
S1  27.97,70.62 180 bottom
S2  27.97,63.43 180 bottom
S3  27.97,56.24 180 bottom
S4  27.97,49.05 180 bottom
S5  27.97,41.87 180 bottom
S6  27.97,34.68 180 bottom
S7  27.97,27.49 180 bottom
S8  27.97,20.3 180 bottom
SW1  43.6,9.3 0 bottom
U$1  51.4,105 180 bottom
VR1  54.75,67.12 90 bottom
VR2  6.47,71.95 180 bottom
VR3  62.1,87.72 90 bottom
VR4  6.47,47.4 180 bottom

### Tracks (layer width: path | path; a pad name or v marks a point on that pad's centre or on a via)
+3V3  (via drill 0.38)
  Top 0.15: R58.1 25,69.1 v25.8,68.3
  Top 1.27: P2.23 49.07,45.27 v49.1,45.3 | P1.14 57.37,57.97 v57.3,57.9
  Bottom 0.15: v25.8,68.3 26.75,67.35 31,67.35
  Bottom 0.152: R30.2 31,67.35 30.95,67.35 30.2,66.6 30.2,63.7 31.15,62.75 R31.2 33.8,62.45 R32.2 32.45,60.15 32.2,59.9 29.3,59.9 29.3,49.7 29.6,49.4 33.65,49.4 33.77,49.52 | 33.77,49.52 R49.2 | 33.77,49.52 33.77,45.77 R50.2 33.45,45.4 30.3,45.4 30.1,45.2 30.1,35.7 30.25,35.55 R51.2 33.8,31.55 R56.2 32.55,31.45 32,30.9 30.6,30.9 30.6,29.05 34.4,25.25 R57.2 33.55,23.8 30.3,23.8 29.5,23 29.5,19.3 38.55,19.3 R27.2 39.68,18.17 39.68,0.4 42.2,0.4 SW1.C 43.6,9.6 49.85,15.85 C28.1 | C27.2 55.3,17.15 C28.1 | C28.1 56.85,15.85 v57.3,15.4
  pour Route3 (isolate 0.61): 48,1 48,100 58,100 58,1
+5V  (via drill 0.38)
  Top 1.27: P1.24 61.97,45.27 v61.9,45.2
  Top 2.54: U$1.VOUT 59.75,103.07 67.23,103.07 68.6,101.7 v68.6,98.8 v68.6,95.6 v68.6,92
  pour Route3 (isolate 0.61): 60,1 60,100 70,100 70,1
+12V  (via drill 0.38)
  Top 0.15: C31.1 14.85,81.65 v14.8,81.7
  Top 0.152: IC1.4 v14.8,81.7 | IC3.4 17.65,19.8 C34.1 17.3,21.5 v17.4,21.6
  Top 2.54: U$1.VIN 54.57,103.07 41.67,103.07 39.7,101.1 39.7,91.8 39.06,91.17 15.67,91.17 10.9,95.94 v10.9,99.1 v10.9,95.9
  Bottom 0.254: v6.3,96.2 v6.3,98.8 6.3,100.26 C52.+ | C52.+ 10.9,97.86 v10.9,95.9 | C52.+ 8.7,100.06 v8.7,97.6 | C52.+ 8.64,101.36 v10.9,99.1
  Bottom 1.27: v14.8,81.7 14.8,84.57 15.11,84.88 15.11,88.02 10.9,92.23 v10.9,95.9
  pour Route3 (isolate 0.61): 1.5,1 1.5,100 20,100 20,1
  pour Bottom: 5,102 5,95 12,95 12,102
-10V  (via drill 0.38)
  Top 0.152: v17.5,93.2 17.5,93.63 17.9,94.03 | C51.1 22.75,93.05 v22.9,92.9
  Top 0.508: C51.1 R62.2 18.66,94.36 IC10.2 17.9,94.03
  Bottom 0.152: VR4.P$1 15.9,52.33 15.9,72.02 VR2.P$1 16,76.98 16,91.4 17.5,92.9 v17.5,93.2 | v22.9,92.9 22.9,91.9 24,90.8 37.5,90.8 44.6,97.9 56.42,97.9 VR3.P$1 59.6,73.2 57.7,71.3 55.08,71.3 VR1.P$1
-12V  (via drill 0.38)
  Top 0.15: C32.2 27.32,80.83 27.32,80.8
  Top 0.152: v29.6,80.7 29.5,80.8 27.32,80.8 26.43,81.7 IC1.11 | IC3.11 24.93,20.1 29.05,20.1 C33.2 31.25,20.15 v31.3,20.2
  Top 0.508: R62.1 22.3,97.8 v25.6,97.8
  Bottom 0.254: C53.- 34.55,100.06 v35.4,99.2 35.4,95 v36.2,94.2 36.1,94.1 v25.2,94.1 | v25.2,94.1 25.2,97.4 v25.6,97.8 28.8,97.8 v30.2,99.2 | v25.2,94.1 25.6,94.1 27.4,95.9 v30.8,95.9
  pour Route3 (isolate 0.406): 24,1 24,100 44,100 44,1
  pour Bottom: 37.5,93 24.1,93 24.1,103.8 37.5,103.8
A0
  Top 0.152: R2.2 C1.2 C2.2 42.35,87 22.7,87 22.6,86.9 23.99,85.51 IC1.14 33.09,85.51 43.34,75.27 J1.10
A1
  Top 0.152: R10.2 C5.2 C6.2 44.3,94.22 43.57,93.49 43.57,92.67 39.3,88.4 19.7,88.4 18.1,86.8 19.39,85.51 | IC1.1 19.39,85.51 | 19.39,85.51 20.49,85.51 22.4,83.6 33.2,83.6 42.1,74.7 42.1,71.91 J1.9
A2
  Top 0.152: R6.2 C3.2 C4.2 14,79.95 16.06,77.89 IC1.7 20.49,77.89 22.4,79.8 35.4,79.8 39.6,75.6 39.6,72 41.3,72 42,71.3 42,69.47 J1.8
A3
  Top 0.152: R14.2 C7.2 C8.2 16.76,59.71 16.76,70.66 22.9,76.8 22.9,77.89 IC1.8 31.61,77.89 37.5,72 38.5,72 39.6,70.9 39.6,69.4 41.4,69.4 42.1,68.7 42.1,67.4 43.34,66.17 J1.7
ADC1
  Top 0.152: 24.75,12.9 44.52,12.9 J3.3 | C11.2 24.75,12.9 | 24.75,12.9 24.1,12.9 23,14 23,20.97 20.36,23.61 IC3.1 19.32,23.51 17.19,23.51 15.1,21.42 15.1,17.2 12.95,15.05 C12.2 R19.2
ADC2
  Top 0.152: J3.2 45.66,11.5 23.65,11.5 C10.2 21.25,14.16 IC3.7 18.14,15.99 C9.2 17.55,15.4 R22.2
D0
  Bottom 0.152: R55.2 40.8,79.31 P2.1
D1
  Bottom 0.152: P2.2 38.26,79.34 R54.2
D2
  Bottom 0.152: R53.2 36.9,78.2 36.9,72.03 P2.4
D3
  Bottom 0.152: R52.2 36,76.7 36,69.9 37.77,68.13 P2.6
D4
  Bottom 0.152: S1.A2 33.9,70.92 R30.1 37.36,65.59 P2.8
D5
  Bottom 0.152: P2.10 36.85,64.45 R31.1 32.87,65.68 S2.A2
D6
  Bottom 0.152: S3.A2 33.87,58.49 R32.1 33.8,55.59 36.5,52.89 P2.18
D7
  Bottom 0.152: P2.20 37.3,51.3 37.25,51.25 R49.1 33.74,51.3 S4.A2
D8
  Bottom 0.152: S5.A2 33.73,44.12 R50.1 34.49,44.05 P2.22
D9
  Bottom 0.152: P2.24 37.97,45.27 36.3,43.6 36.3,40.95 33.8,38.45 R51.1 33.48,36.93 S6.A2
D10
  Bottom 0.152: S7.A2 33.79,29.74 R56.1 35.1,31.05 35.1,34.93 37,36.83 37,40.9 37.5,41.4 39.46,41.4 P2.25
D11
  Bottom 0.152: S8.A2 34,22.55 R57.1 36,24.55 36,34.8 37.6,36.4 39.5,36.4 39.5,38.9 P2.27
D13
  Bottom 0.152: SW1.E 41.1,18.35 R27.1 41.8,18.4 50.1,26.7 64.4,26.7 66.19,28.5 P1.35
D14
  Bottom 0.152: SW1.A 46.1,10.8 49.45,14.15 R29.2 C28.2 55.35,14.2 58,14.2 59.2,15.4 59.2,17 69.8,27.6 69.8,37.9 68.7,39 68.6,38.9 62.9,38.9 62.4,38.4 62.4,36.6 62.7,36.3 62.7,36.07 P1.32
D15
  Bottom 0.152: SW1.B 41.1,8.7 51.35,18.95 C27.1 R28.1 59.55,18.95 68.8,28.2 68.8,35.9 68.3,36.4 65.1,36.4 63.85,37.65 P1.30
DAC1
  Top 0.15: 33.65,26.4 35.95,28.7 41.4,28.7 42.1,29.4 42.1,33.76 J2.2
  Top 0.152: 33.65,26.4 R24.1
DAC2
  Top 0.15: R26.1 45.3,35.7 J2.1
GND  (via drill 0.38)  (64 unrouted)
  Top 0.15: C32.1 28.65,82.55 v28.7,82.6
  Top 0.152: C33.1 27.7,21.85 27.7,21.1 v26.3,21.1 26.27,21.07 IC3.12
  Top 0.406: IC2.3 19.7,66.25 C35.2 v19.1,67
  Top 1.27: P1.22 61.41,47.81 v61.4,47.8 | P1.16 61.53,55.43 v61.5,55.4 | J1.2 v45.39,52.89 v45.4,52.9
  Bottom 0.15: v41.1,88.86 D1.C
  pour Route2 (rank 2): 0,0 0,104.8 70.8,104.8 70.8,0
  pour Bottom: 0,0 0,105 71.1,105 71.1,0
  pour Top: 0,0 0,105 71.1,105 71.1,0
N$1
  Top 0.152: R3.1 54.9,81.2 A0J.P$1
N$2
  Top 0.152: R1.2 R2.1 C1.1 45.25,87.9 21.77,87.9 20.69,86.81 23.26,84.24 IC1.13
N$3
  Top 0.152: R3.2 R4.2 R1.1
N$4
  Top 0.152: VR1.P$2 56.6,75.97 56.6,85.3 55.15,86.75 R4.1
N$5
  Top 0.152: R5.2 R6.1 C3.1 13.9,81.65 16.39,79.16 IC1.6
N$6
  Top 0.152: R7.2 3.6,79.95 R8.2 R5.1
N$7
  Top 0.152: A2J.P$1 R7.1
N$8
  Top 0.305: VR2.P$2 11.95,71.95 10.1,73.8 10.1,78.1 9.95,78.25 R8.1
N$9
  Top 0.152: R9.2 R10.1 C5.1 43.75,96.25 41.2,93.7 41.2,91.18 39.12,89.1 17.4,89.1 16.5,88.2 16.5,85.2 17.46,84.24 IC1.2
N$10
  Top 0.152: R11.2 R12.2 R9.1
N$11
  Top 0.152: A1J.P$1 R11.1
N$12
  Top 0.152: R12.1 60.58,96.25 VR3.P$2
N$13
  Top 0.152: IC1.9 22.3,79.16 22.3,78.1 15.5,71.3 15.5,59.9 12.65,57.05 C7.1 R14.1 R13.2
N$14
  Top 0.152: R15.2 R16.2 R13.1
N$15
  Top 0.152: A3J.P$1 2.08,57.23 R15.1
N$16
  Top 0.305: VR4.P$2 9.9,50.97 9.9,53.4 9.65,53.65 R16.1
N$20
  Top 0.152: ADC1.P$1 4.3,0.95 R17.1
N$21
  Top 0.152: R17.2 0.8,3.35 0.8,10.95 R18.1
N$22
  Top 0.152: R18.2 8.2,14.15 R19.1 C12.1 12.15,13.35 15.8,17 15.8,21.5 16.64,22.34 IC3.2
N$23
  Top 0.152: R20.2 18.2,9.5 15.85,11.85 R22.1 15.85,15.4 C9.1 15.95,15.95 17.26,17.26 IC3.6
N$24
  Top 0.152: IC3.9 26.71,17.26 C26.1 R25.1 32.1,17.45 36.3,21.65 41.5,21.65 R26.2
N$25
  Top 0.152: R21.2 R20.1
N$26
  Top 0.152: ADC2.P$1 17.9,1.25 R21.1
N$27
  Top 0.152: C14.2 39.35,26.3 60.4,26.3 70.2,16.5 70.2,2.1 69.35,1.25 DAC1.P$1
N$28
  Top 0.152: IC3.14 26.94,23.61 R23.2 C15.2 C13.1 34.2,23.55 C14.1
N$29
  Top 0.152: R24.2 29.15,25.3 C15.1 R23.1 22.85,25.25 22.5,24.9 22.5,22.4 22.7,22.2 24.48,22.2 IC3.13
N$30
  Bottom 0.152: R55.1 D4.A | D4.A
N$31
  Top 0.152: IC3.8 26.66,15.99 C26.2 R25.2 31,15.75 C25.1 32.5,15.65 C16.1
N$32
  Top 0.152: C16.2 39.55,20.3 50.3,20.3 52.4,22.4 52.4,24.3 53.2,25.1 59.8,25.1 61.4,23.5 61.4,2.7 59.95,1.25 DAC2.P$1
N$37
  Bottom 0.152: R54.1 D3.A | D3.A
N$41
  Bottom 0.152: R53.1 D2.A | D2.A
N$45
  Bottom 0.152: R52.1 D1.A | D1.A
N$52
  Bottom 1.27: JP2.1 JP2.2 14.36,100.58 D9.A
N$53
  Bottom 1.27: D10.C 26.87,102.2 JP2.9 JP2.10
VCC  (via drill 0.38)
  Top 0.152: IC1.3 22.07,82.97 | 22.07,82.97 v22.1,83 | IC1.12 22.1,82.97 | 22.1,82.97 22.07,82.97 | IC1.5 20.93,80.43 22.1,81.6 | 22.1,81.6 22.1,82.97 | IC1.10 23.27,80.43 22.1,81.6 | IC3.3 20.53,21.07 v21.9,19.7 20.73,18.53 IC3.5
  Top 0.406: IC2.2 22.15,65.1 C35.1 22.25,67.1 R58.2 22.25,70.35 v22.2,70.4
  pour Route3 (isolate 0.254): 21,1 21,100 23,100 23,1

### Text on the board
tPlace: P1 | P2 | A. McPherson 03/18 | Bela Mini
bPlace: D1 | D0 | A0 | D2 | A1 | bela.io | D3 | 2 | D4 | A3 | D5 | A4 | A5 | A6 | 3.3V | GND | A7 | D6 | GND | D7 | REF | D8 | GND | GND | 5V | D9 | 3.3V | D10 | D11 | R | D15 | rev. B2 | L | D14 | OUT | IN | D13
Mask: +12V | 5V | -12V | 3v3